# EAGLE design WS2812B-Breakout-v1 (EAGLE 5.12)
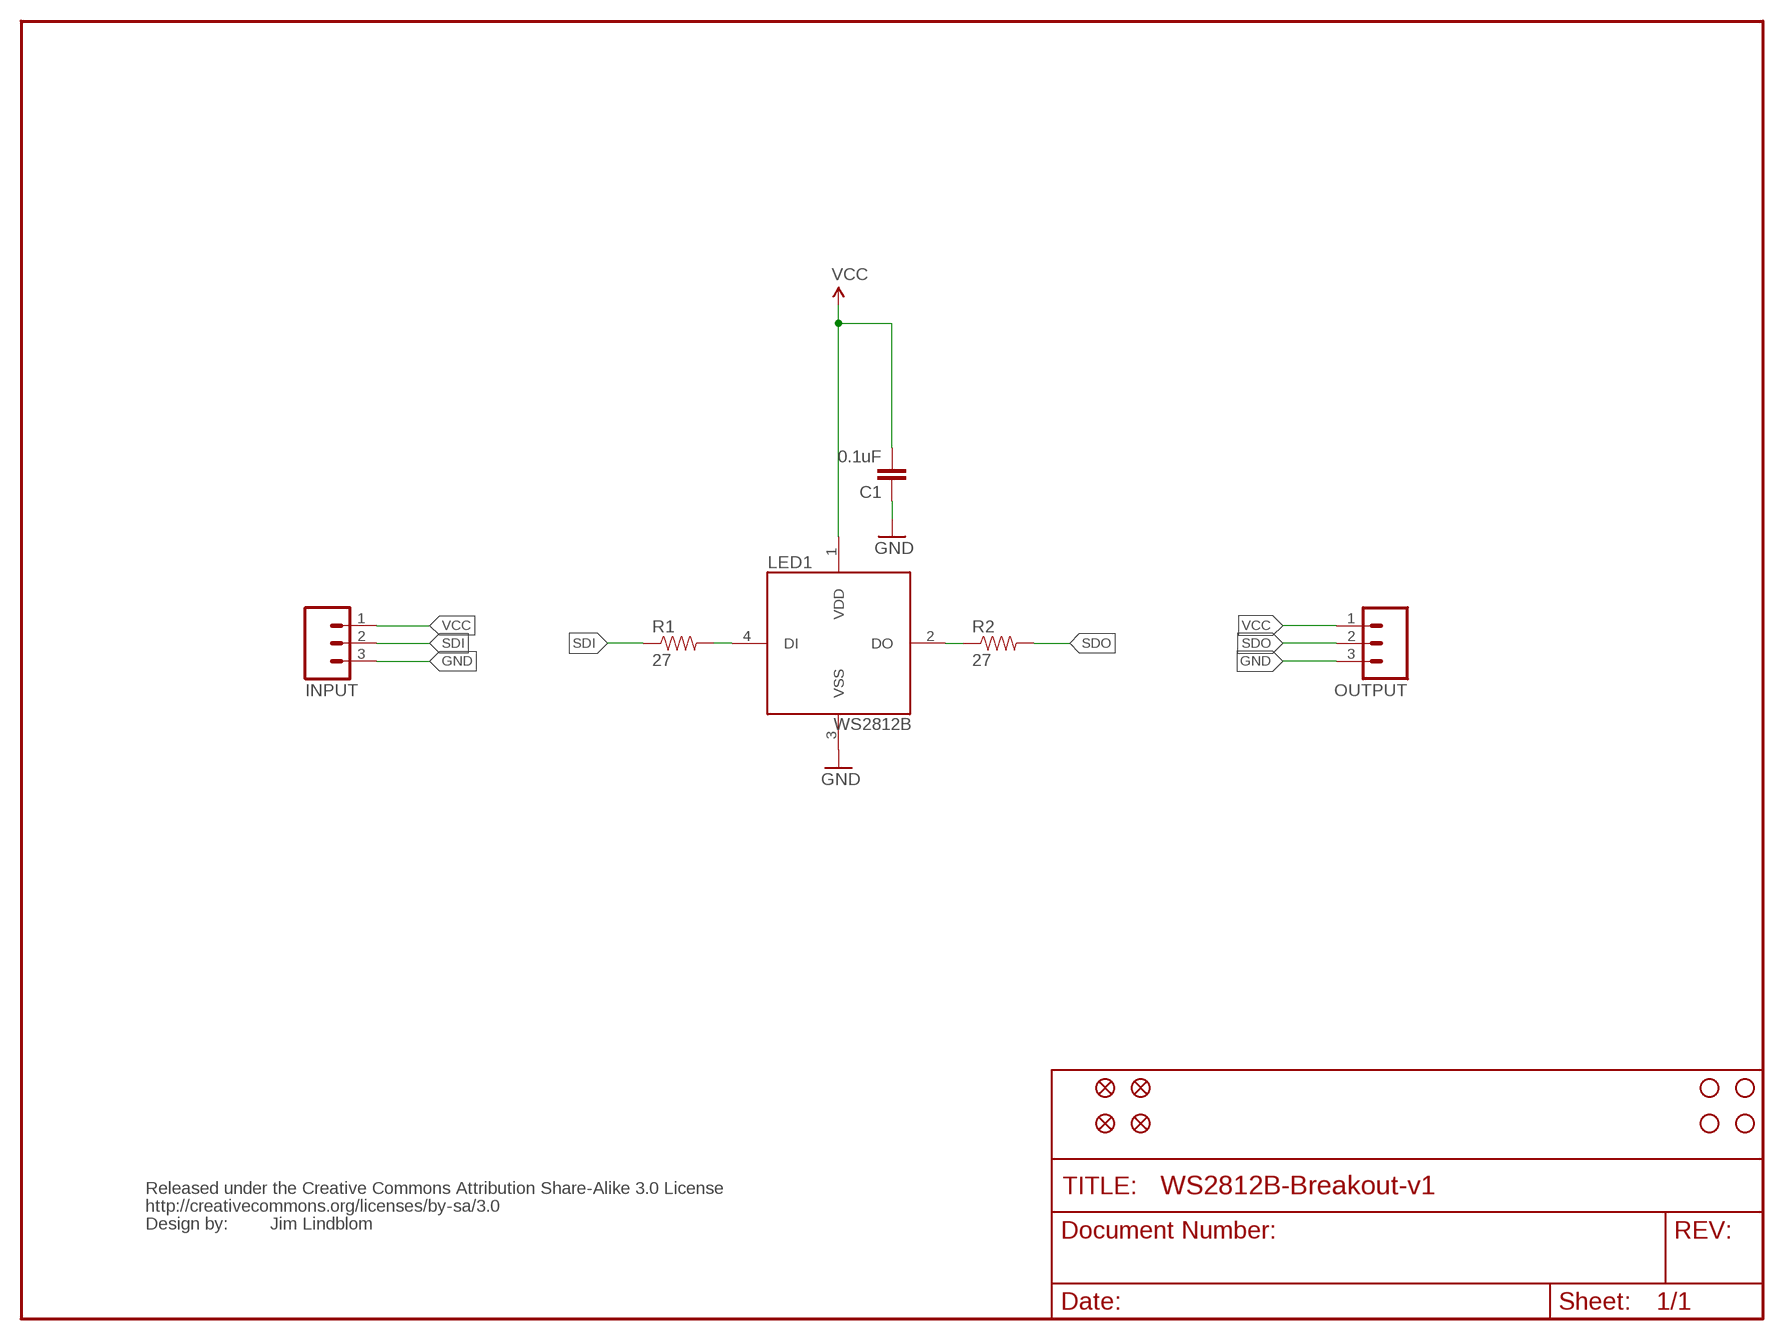
[diagram p0: schematic, sheet 1]

## Parts
C1  0.1uF  CAP0402-CAP  [0402-CAP]
INPUT  M03PTH  [1X03]
JP1  STAND-OFF  [STAND-OFF]
JP2  STAND-OFF  [STAND-OFF]
JP4  STAND-OFF  [STAND-OFF]
JP5  STAND-OFF  [STAND-OFF]
JP6  FIDUCIAL1X2  [FIDUCIAL-1X2]
JP7  FIDUCIAL1X2  [FIDUCIAL-1X2]
JP8  FIDUCIAL1X2  [FIDUCIAL-1X2]
JP9  FIDUCIAL1X2  [FIDUCIAL-1X2]
LED1  WS2812B  [LED-TRICOLOR-5050-4PIN]
OUTPUT  M03PTH  [1X03]
R1  27  RESISTOR0402-RES  [0402-RES]
R2  27  RESISTOR0402-RES  [0402-RES]
U$1  CREATIVE_COMMONS  [CREATIVE_COMMONS]

## Nets
GND: C1.1 INPUT.3 LED1.3(VSS) OUTPUT.3
N$1: LED1.4(DI) R1.2
N$2: LED1.2(DO) R2.1
SDI: INPUT.2 R1.1
SDO: OUTPUT.2 R2.2
VCC: C1.2 INPUT.1 LED1.1(VDD) OUTPUT.1

## Notes on the sheet
- Jim Lindblom

## Library data of the parts
C1 = SparkFun:CAP: Capacitor Standard 0603 ceramic capacitor, and 0.1" leaded capacitor.
INPUT OUTPUT = SparkFun:M03: Header 3 Standard 3-pin 0.1" header. Use with straight break away headers (SKU : PRT-00116), right angle break away headers (PRT-00553), swiss pins (PRT-00743), machine pins (PRT-00117), and female headers (PRT-00115). Molex polarized connector foot print use with SKU : PRT-08232 with associated crimp pins and housings.
JP1 JP2 JP4 JP5 = SparkFun:STAND-OFF: Stand Off This is the mechanical footprint for a #4 phillips button head screw. Use the keepout ring to avoid running the screw head into surrounding components. SKU : PRT-00447
JP6-JP9 = SparkFun:FIDUCIAL: Fiducial Alignment Points Various fiducial points for machine vision alignment.
LED1 = rbg-worldsemi-led:WS2812B
R1 R2 = SparkFun:RESISTOR: Resistor Basic schematic elements and footprints for 0603, 1206, and PTH resistors.
U$1 = SparkFun:CREATIVE_COMMONS

## Board
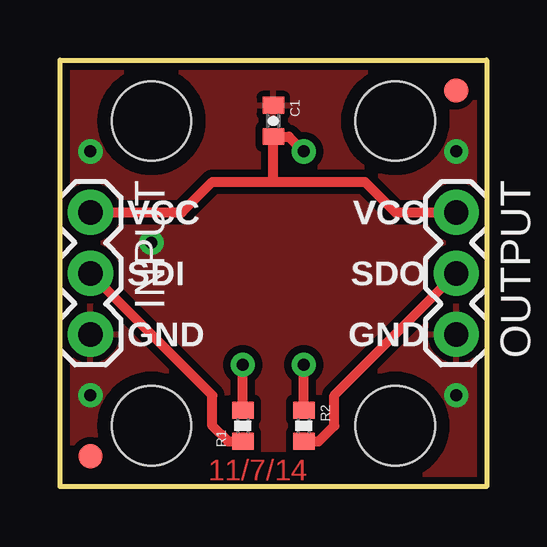
[diagram p1: board, top side]
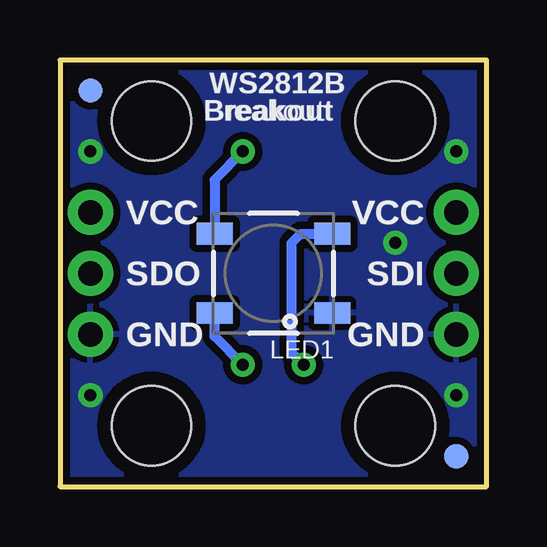
[diagram p2: board, bottom side, seen from below]

Size 17.78 x 17.78 mm. Coordinates in mm from the lower left corner, seen from the top.
Outline: 0,0 0,17.78 17.78,17.78 17.78,0 0,0
Copper layers (1*16): Top 0.035mm / dielectric 1.5mm / Bottom 0.035mm
Design rules "SparkFun *": minimum track width 8mil, minimum drill 19mil, track to track 8mil, track to pad 8mil, pad to pad 8mil, via to via 8mil, smd to smd 8mil, copper to edge 8mil, drill to drill 8mil, minimum pad ring 12mil, minimum via ring 10mil, stop-mask expansion 4mil, vias tented up to drill 20mil, thermal gap 10mil

### Footprints (pad centres in the part's own frame; a part is rotated, then mirrored left to right if it is on the bottom)
0402-CAP = smd 0.7 x 0.9: 1 -0.65,0; 2 0.65,0
1X03 = drill 1.016 pad 1.88 round: 1 0,0; 2 2.54,0; 3 5.08,0
STAND-OFF = hole 3.302: 0,0
FIDUCIAL-1X2 = smd 1 x 1: 1 0,0
LED-TRICOLOR-5050-4PIN = smd 1.5 x 0.9: 1 2.45,-1.65; 2 2.45,1.65; 3 -2.45,1.65; 4 -2.45,-1.65
0402-RES = smd 0.7 x 0.9: 1 -0.65,0; 2 0.65,0

### Placement (x,y rotation side)
C1  8.89,15.24 270 top
INPUT  1.27,11.43 270 top
JP1  13.97,15.24 0 top
JP2  3.81,2.54 0 top
JP4  3.81,15.24 0 top
JP5  13.97,2.54 0 top
JP6  16.51,16.51 0 top
JP7  1.27,1.27 0 top
JP8  1.27,1.27 0 bottom
JP9  16.51,16.51 0 bottom
LED1  8.89,8.89 180 bottom
OUTPUT  16.51,11.43 270 top
R1  7.62,2.54 90 top
R2  10.16,2.54 270 top
U$1  -13.97,-8.89 0 top  (outside the outline)

### Tracks (layer width: path | path; a pad name or v marks a point on that pad's centre or on a via)
GND  (via drill 0.5)
  other vias: 3.81,10.16 1.27,3.81 16.51,3.81 1.27,13.97 16.51,13.97
  pour Top (isolate 0.305): 0,17.78 0,0 17.78,0 17.78,17.78
  pour Bottom (isolate 0.305): 0,17.78 0,0 17.78,0 17.78,17.78
N$1  (via drill 0.5)
  Top 0.406: R1.2 v7.62,5.08
  Bottom 0.406: LED1.4 7.75,10.54 8.13,10.16 8.13,5.59 v7.62,5.08
N$2  (via drill 0.5)
  Top 0.406: R2.1 v10.16,5.08
  Bottom 0.406: LED1.2 11.34,6.26 v10.16,5.08
SDI
  Top 0.406: R1.1 7,1.89 6.35,2.54 6.35,3.81 INPUT.2
SDO
  Top 0.406: R2.2 10.78,1.89 11.43,2.54 11.43,3.81 OUTPUT.2
VCC  (via drill 0.5)
  Top 0.406: INPUT.1 5.08,11.43 6.35,12.7 8.89,12.7 | 8.89,12.7 12.7,12.7 13.97,11.43 OUTPUT.1 | 8.89,12.7 C1.2 9.54,14.59 v10.16,13.97
  Bottom 0.406: LED1.1 11.34,12.79 v10.16,13.97

### Text on the board
Top: 11/7/14
tPlace: VCC | VCC | SDO | SDI | GND | GND
bPlace: WS2812B | Breakout | VCC | VCC | SDI | SDO | GND | GND
_tsilk: VCC | VCC | SDO | SDI | GND | GND
_bsilk: WS2812B | Breakout | VCC | VCC | SDI | SDO | GND | GND